# Altium schematic sheet K4B4G1646.SchDoc
size 381 x 635 mm
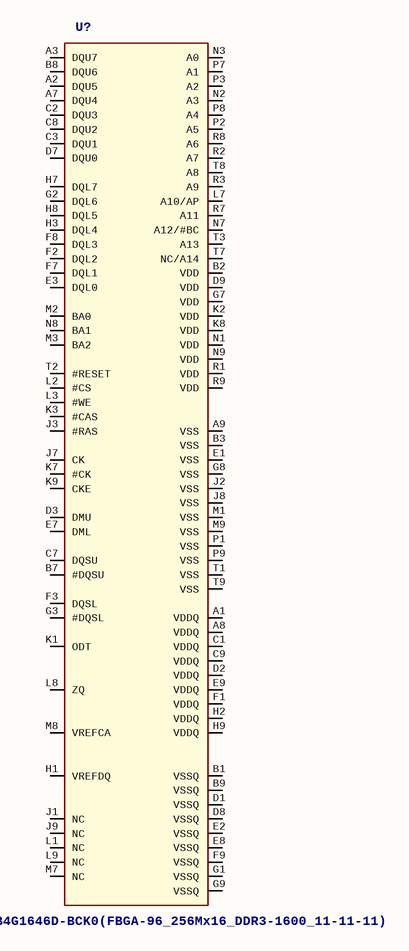
[diagram p0: K4B4G1646.SchDoc]

## Parts
U?  K4B4G1646D-BCK0(FBGA-96_256Mx16_DDR3-1600_11-11-11)  [FBGA96(HYNIX_SAMSUNG_512MX16_DDR3)]

## Nets

Not connected (* = marked no-connect by the designer): U? A1(VDDQ) A2(DQU5) A3(DQU7) A7(DQU4) A8(VDDQ) A9(VSS) B1(VSSQ) B2(VDD) B3(VSS) B7(#DQSU) B8(DQU6) B9(VSSQ) C1(VDDQ) C2(DQU3) C3(DQU1) C7(DQSU) C8(DQU2) C9(VDDQ) D1(VSSQ) D2(VDDQ) D3(DMU) D7(DQU0) D8(VSSQ) D9(VDD) E1(VSS) E2(VSSQ) E3(DQL0) E7(DML) E8(VSSQ) E9(VDDQ) F1(VDDQ) F2(DQL2) F3(DQSL) F7(DQL1) F8(DQL3) F9(VSSQ) G1(VSSQ) G2(DQL6) G3(#DQSL) G7(VDD) G8(VSS) G9(VSSQ) H1(VREFDQ) H2(VDDQ) H3(DQL4) H7(DQL7) H8(DQL5) H9(VDDQ) J1(NC) J2(VSS) J3(#RAS) J7(CK) J8(VSS) J9(NC) K1(ODT) K2(VDD) K3(#CAS) K7(#CK) K8(VDD) K9(CKE) L1(NC) L2(#CS) L3(#WE) L7(A10/AP) L8(ZQ) L9(NC) M1(VSS) M2(BA0) M3(BA2) M7(NC) M8(VREFCA) M9(VSS) N1(VDD) N2(A3) N3(A0) N7(A12/#BC) N8(BA1) N9(VDD) P1(VSS) P2(A5) P3(A2) P7(A1) P8(A4) P9(VSS) R1(VDD) R2(A7) R3(A9) R7(A11) R8(A6) R9(VDD) T1(VSS) T2(#RESET) T3(A13) T7(NC/A14) T8(A8) T9(VSS)

## Library data of the parts
U? = K4B8G1646Q-MYK0(FBGA-96_512MX16_DDR3-1600)